# EAGLE board Stovetop-v1.1 (EAGLE 9.2.2), part 1 of 2
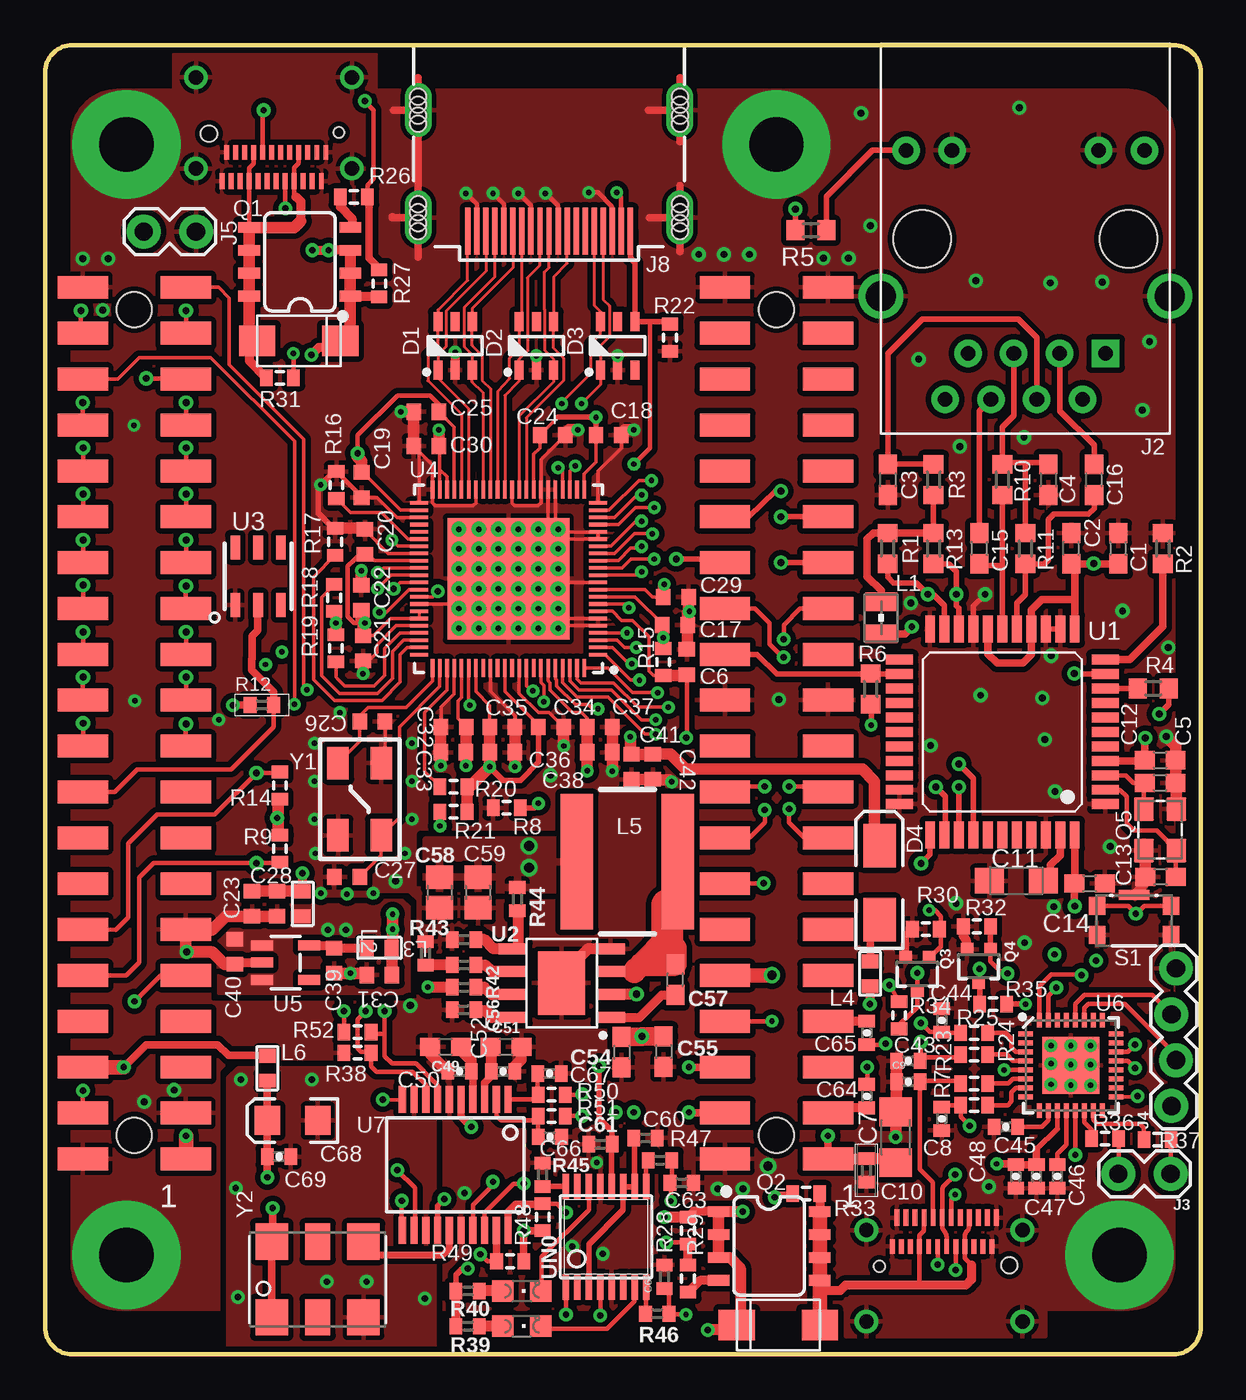
[diagram p9: board, top side]
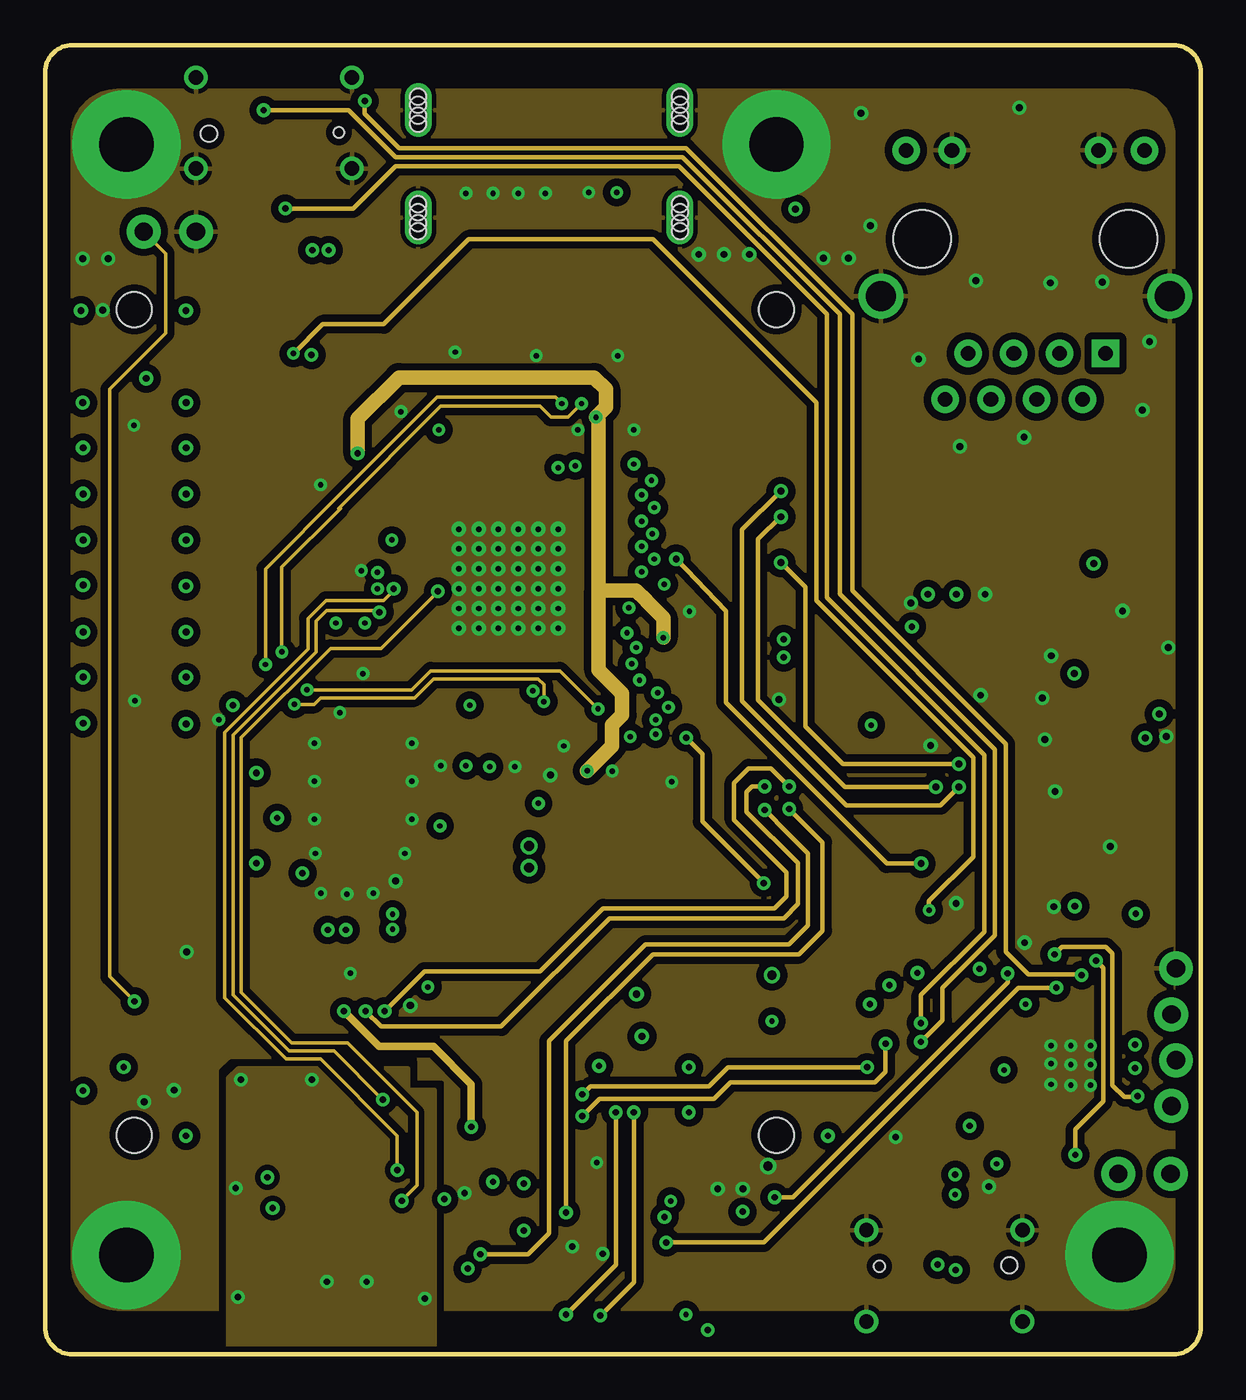
[diagram p10: board, inner layer Route2]
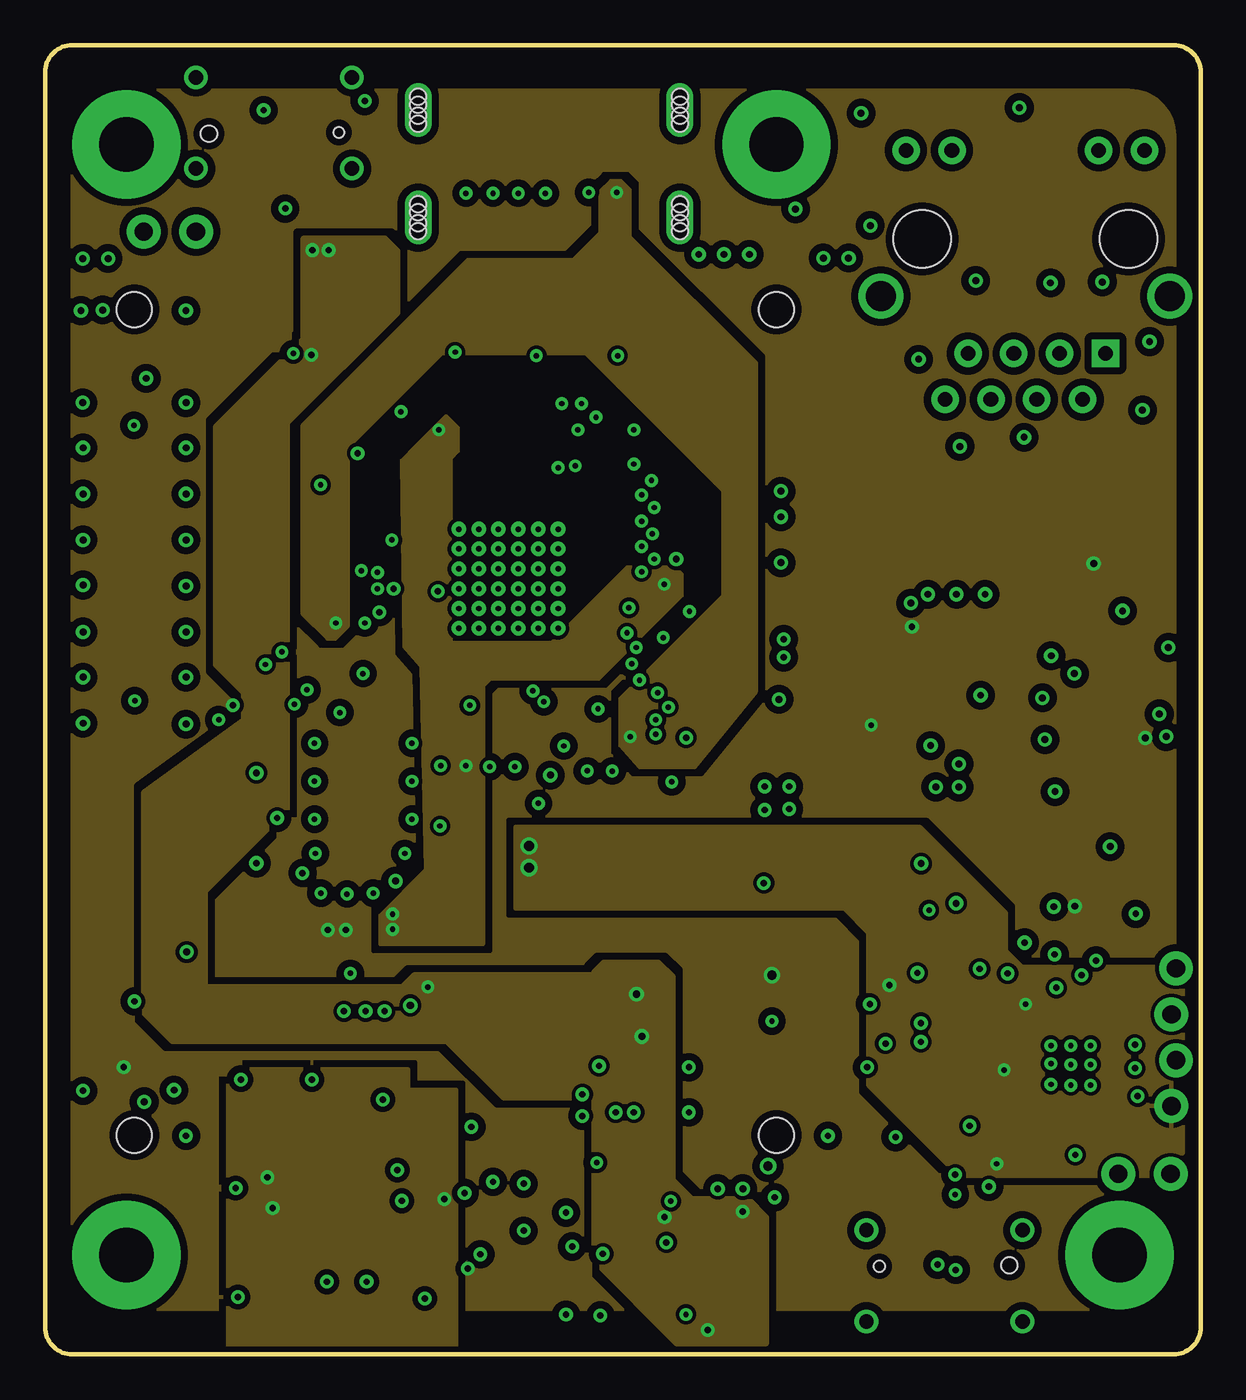
[diagram p11: board, inner layer Route15]
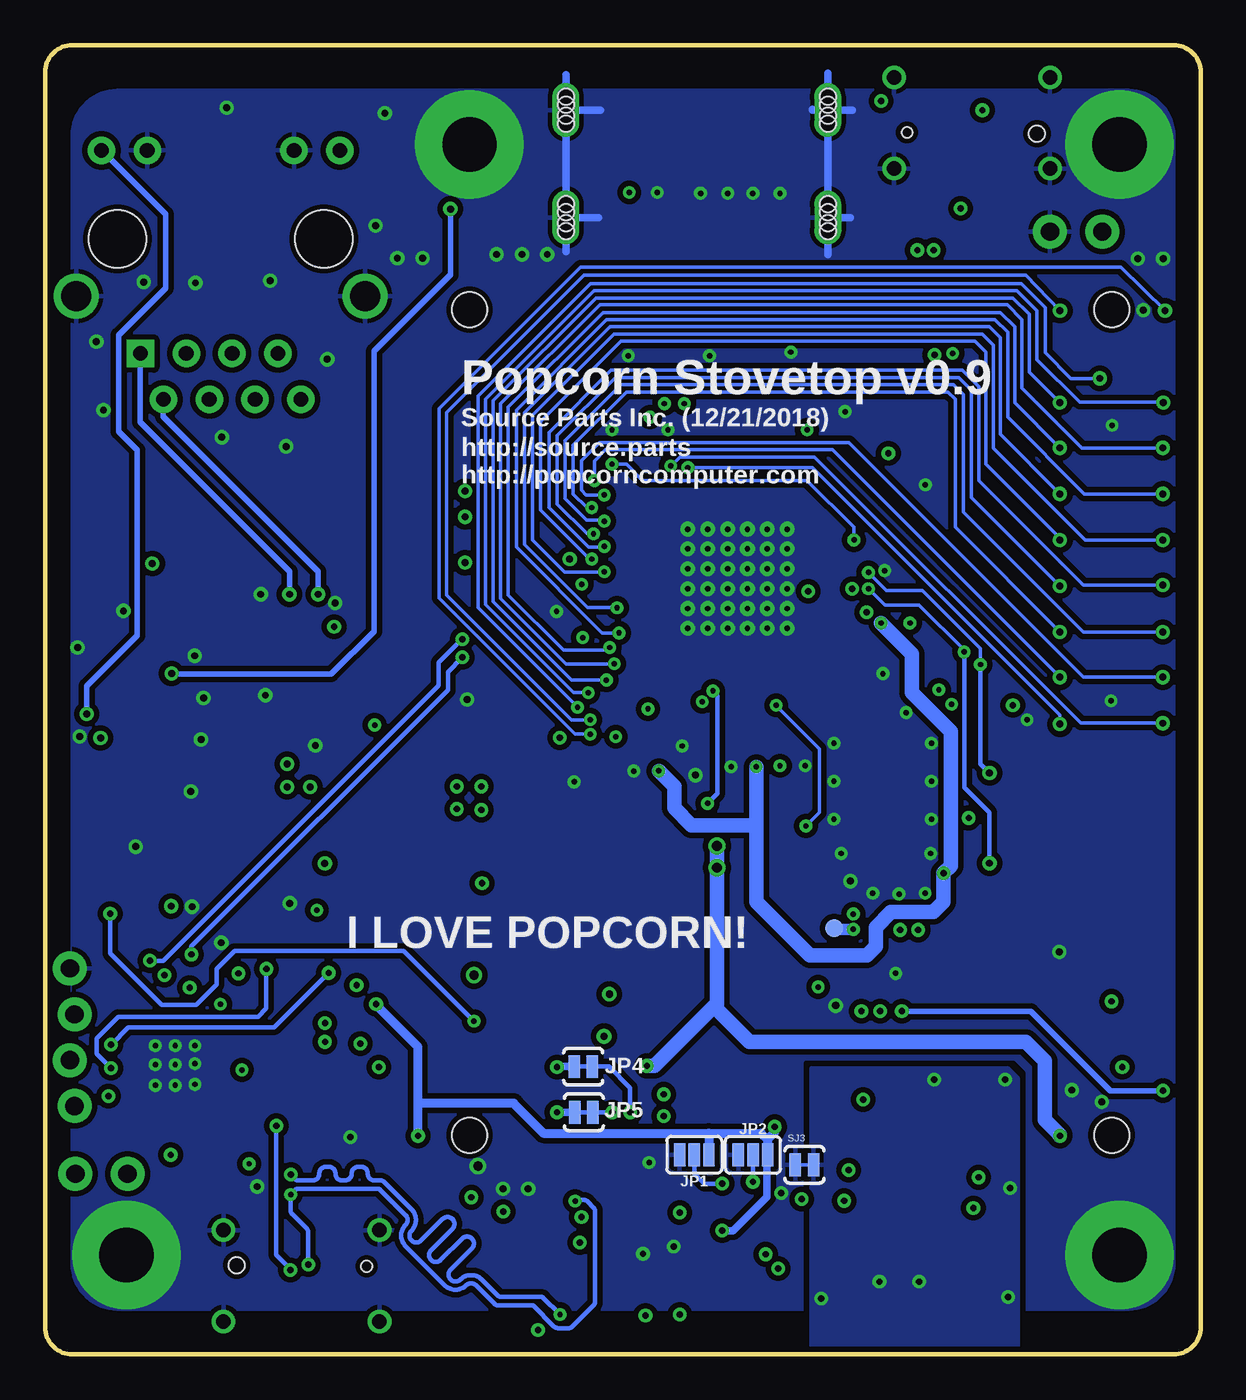
[diagram p12: board, bottom side, seen from below]

Size 64 x 72.5 mm. Coordinates in mm from the lower left corner, seen from the top.
Outline: 62.5,72.5 1.5,72.5 arc90 0,71 0,1.5 arc90 1.5,0 62.5,0 arc90 64,1.5 64,71 arc90 62.5,72.5
Copper layers (1*2*15*16): Top 0.035mm / dielectric 0.2mm / Route2 0.035mm / dielectric 0.2mm / Route15 0.035mm / dielectric 0.2mm / Bottom 0.035mm
Design rules "Stovetop *": minimum track width 8mil, minimum drill 0.3mm, track to track 8mil, track to pad 8mil, pad to pad 8mil, via to via 8mil, smd to smd 8mil, copper to edge 12mil, drill to drill 10mil, minimum pad ring 10mil, minimum via ring 8mil, stop-mask expansion 4mil, vias tented up to drill 24mil, thermal gap 10mil

## Footprints (pad centres in the part's own frame; a part is rotated, then mirrored left to right if it is on the bottom)
C0603 = smd 1.1 x 1: 1 -0.85,0; 2 0.85,0
1608_0603 = smd 0.8 x 0.9: 1 -0.7,0; 2 0.7,0
C1206 = smd 1.6 x 1.8: 1 -1.4,0; 2 1.4,0
0402-CAP = smd 0.7 x 0.9: 1 -0.65,0; 2 0.65,0
C0402 = smd 0.7 x 0.9: 1 -0.65,0; 2 0.65,0
SMC_A = smd 1.6 x 1.4: + -1.5,0; - 1.5,0
0603 = smd 1.1 x 1: 1 -0.85,0; 2 0.85,0
C0805 = smd 1.3 x 1.5: 1 -0.85,0; 2 0.85,0
EIA3216 = smd 1.4 x 1.6: A 1.4,0; C -1.4,0
T_SOT95P285X90-6N = smd 1.05 x 0.5: 1 0,0; 2 0,-0.95; 3 0,-1.9; 4 2.7,-1.9; 5 2.7,-0.95; 6 2.7,0
SMA = smd 2.4 x 1.8: 1 -2.05,0; 2 2.05,0
SMA-SS34 = smd 2 x 1.7: 1 0,-1.4; 2 4.6,-1.4
98401-801-40LF = smd 1.27 x 2.79: 1 -24.175,-2.855; 2 -24.175,2.855; 3 -21.635,-2.855; 4 -21.635,2.855; 5 -19.095,-2.855; 6 -19.095,2.855; 7 -16.555,-2.855; 8 -16.555,2.855; 9 -14.015,-2.855; 10 -14.015,2.855; 11 -11.475,-2.855; 12 -11.475,2.855; 13 -8.935,-2.855; 14 -8.935,2.855; 15 -6.395,-2.855; 16 -6.395,2.855; 17 -3.855,-2.855; 18 -3.855,2.855; 19 -1.315,-2.855; 20 -1.315,2.855; 21 1.225,-2.855; 22 1.225,2.855; 23 3.765,-2.855; 24 3.765,2.855; 25 6.305,-2.855; 26 6.305,2.855; 27 8.845,-2.855; 28 8.845,2.855; 29 11.385,-2.855; 30 11.385,2.855; 31 13.925,-2.855; 32 13.925,2.855; 33 16.465,-2.855; 34 16.465,2.855; 35 19.005,-2.855; 36 19.005,2.855; 37 21.545,-2.855; 38 21.545,2.855; 39 24.085,-2.855; 40 24.085,2.855; 41 -24.175,32.705; 42 -24.175,38.415; 43 -21.635,32.705; 44 -21.635,38.415; 45 -19.095,32.705; 46 -19.095,38.415; 47 -16.555,32.705; 48 -16.555,38.415; 49 -14.015,32.705; 50 -14.015,38.415; 51 -11.475,32.705; 52 -11.475,38.415; 53 -8.935,32.705; 54 -8.935,38.415; 55 -6.395,32.705; 56 -6.395,38.415; 57 -3.855,32.705; 58 -3.855,38.415; 59 -1.315,32.705; 60 -1.315,38.415; 61 1.225,32.705; 62 1.225,38.415; 63 3.765,32.705; 64 3.765,38.415; 65 6.305,32.705; 66 6.305,38.415; 67 8.845,32.705; 68 8.845,38.415; 69 11.385,32.705; 70 11.385,38.415; 71 13.925,32.705; 72 13.925,38.415; 73 16.465,32.705; 74 16.465,38.415; 75 19.005,32.705; 76 19.005,38.415; 77 21.545,32.705; 78 21.545,38.415; 79 24.085,32.705; 80 24.085,38.415 | hole 1.95: 22.86,0; -22.86,0; -22.86,35.56; 22.86,35.56
HR911105A = drill 0.813 pad 1.524 square: 1 4.445,-6.35 | drill 0.813 pad 1.524: 2 3.175,-8.89; 3 1.905,-6.35; 4 0.635,-8.89; 5 -0.635,-6.35; 6 -1.905,-8.89; 7 -3.175,-6.35; 8 -4.445,-8.89; 9 6.604,4.902; 10 4.064,4.902; 11 -4.064,4.902; 12 -6.604,4.902 | drill 1.651 pad 2.159: 13 8.001,-3.175; 14 -8.001,-3.175 | hole 3.2: 5.715,0; -5.715,0
1X02_LOCK = drill 1.016 pad 1.88: 1 -0.178,0; 2 2.718,0
1X04_LOCK = drill 1.016 pad 1.88: 1 0,0.127; 2 2.54,-0.127; 3 5.08,0.127; 4 7.62,-0.127
T_MOLEX_45171 = smd 0.3 x 2.6: 1 4.5,10.31; 2 4,10.31; 3 3.5,10.31; 4 3,10.31; 5 2.5,10.31; 6 2,10.31; 7 1.5,10.31; 8 1,10.31; 9 0.5,10.31; 10 0,10.31; 11 -0.5,10.31; 12 -1,10.31; 13 -1.5,10.31; 14 -2,10.31; 15 -2.5,10.31; 16 -3,10.31; 17 -3.5,10.31; 18 -4,10.31; 19 -4.5,10.31 | drill 0.9 pad 1.499 long: 20 -7.25,3.59; 21 7.25,3.59; 22 7.25,9.55; 23 -7.25,9.55 | hole 0.9: -7.25,10.3; -7.25,8.8; -7.25,9.85; -7.25,9.25; -7.25,4.35; -7.25,2.85; -7.25,3.9; -7.25,3.3; 7.25,10.3; 7.25,8.8; 7.25,9.85; 7.25,9.25; 7.25,4.35; 7.25,3.9; 7.25,2.85; 7.25,3.3
SMT-JUMPER_3_1-NC_PASTE_SILK = smd 0.635 x 1.27: 1 -0.813,0; 2 0,0; 3 0.813,0
PAD-JUMPER-2-NC_BY_TRACE_YES_SILK = smd 0.635 x 1.27: 1 -0.508,0; 2 0.508,0
WE-KI_0805_B = smd 1.02 x 1.78: 1 -0.89,0; 2 0.89,0
0603' = smd 0.762 x 0.914: 1 -0.686,0; 2 0.686,0
INDUCTOR_NR8040 = smd 7.5 x 1.8: P$1 0,2.8; P$2 0,-2.8
SO08 = smd 0.6 x 1.2: 1 -1.905,-2.8; 2 -0.635,-2.8; 3 0.635,-2.8; 4 1.905,-2.8; 5 1.905,2.8; 6 0.635,2.8; 7 -0.635,2.8; 8 -1.905,2.8
SOT323 = smd 0.7 x 0.7: 1 -0.65,-0.925; 2 0.65,-0.925; 3 0,0.925
CRISTALLI_CRYSTAL3.2X2.5 = smd 1.3 x 1.1: 1 -1.15,-0.9; 2 1.15,-0.9; 3 1.15,0.9; 4 -1.15,0.9
R0603 = smd 1 x 1.1: 1 -0.85,0; 2 0.85,0
J1-0603 = smd 0.7 x 0.9: 1 -0.75,0; 2 0.75,0
R0402 = smd 0.7 x 0.9: 1 -0.65,0; 2 0.65,0
LED-805 = smd 1.2 x 1.2: A 0,-1.05; C 0,1.05
KMR221GLFS_SW_KMR221GLFS = smd 0.9 x 1: 1 -2.05,0.8; 2 -2.05,-0.8; 3 2.05,-0.8; 4 2.05,0.8 | smd 1.7 x 0.55: 5 0,1.425
SJ_2S-TRACE = smd 0.635 x 1.27: 1 -0.508,0; 2 0.508,0
TP-1MMX1MM = smd 1 x 1: 0 0,0
TQFP44 = smd 0.55 x 1.5: P1 -4,-5.7; P2 -3.2,-5.7; P3 -2.4,-5.7; P4 -1.6,-5.7; P5 -0.8,-5.7; P6 0,-5.7; P7 0.8,-5.7; P8 1.6,-5.7; P9 2.4,-5.7; P10 3.2,-5.7; P11 4,-5.7; P23 4,5.7; P24 3.2,5.7; P25 2.4,5.7; P26 1.6,5.7; P27 0.8,5.7; P28 0,5.7; P29 -0.8,5.7; P30 -1.6,5.7; P31 -2.4,5.7; P32 -3.2,5.7; P33 -4,5.7 | smd 1.5 x 0.55: P12 5.7,-4; P13 5.7,-3.2; P14 5.7,-2.4; P15 5.7,-1.6; P16 5.7,-0.8; P17 5.7,0; P18 5.7,0.8; P19 5.7,1.6; P20 5.7,2.4; P21 5.7,3.2; P22 5.7,4; P34 -5.7,4; P35 -5.7,3.2; P36 -5.7,2.4; P37 -5.7,1.6; P38 -5.7,0.8; P39 -5.7,0; P40 -5.7,-0.8; P41 -5.7,-1.6; P42 -5.7,-2.4; P43 -5.7,-3.2; P44 -5.7,-4
SOIC-8-PAD = smd 1.6 x 0.61: 1 -2.7,1.905; 2 -2.7,0.635; 3 -2.7,-0.635; 4 -2.7,-1.905; 5 2.7,-1.905; 6 2.7,-0.635; 7 2.7,0.635; 8 2.7,1.905 | smd 2.62 x 3.51: PAD 0,0
TSOC6 = smd 0.53 x 1.33: 1 -1.27,-1.6; 2 0,-1.6; 3 1.27,-1.6; 4 1.27,1.6; 5 0,1.6; 6 -1.27,1.6
QFN40P1000X1000X90_HS-89M = smd 1 x 0.2: 1 -4.95,4.2; 2 -4.95,3.8; 3 -4.95,3.4; 4 -4.95,3; 5 -4.95,2.6; 6 -4.95,2.2; 7 -4.95,1.8; 8 -4.95,1.4; 9 -4.95,1; 10 -4.95,0.6; 11 -4.95,0.2; 12 -4.95,-0.2; 13 -4.95,-0.6; 14 -4.95,-1; 15 -4.95,-1.4; 16 -4.95,-1.8; 17 -4.95,-2.2; 18 -4.95,-2.6; 19 -4.95,-3; 20 -4.95,-3.4; 21 -4.95,-3.8; 22 -4.95,-4.2; 45 4.95,-4.2; 46 4.95,-3.8; 47 4.95,-3.4; 48 4.95,-3; 49 4.95,-2.6; 50 4.95,-2.2; 51 4.95,-1.8; 52 4.95,-1.4; 53 4.95,-1; 54 4.95,-0.6; 55 4.95,-0.2; 56 4.95,0.2; 57 4.95,0.6; 58 4.95,1; 59 4.95,1.4; 60 4.95,1.8; 61 4.95,2.2; 62 4.95,2.6; 63 4.95,3; 64 4.95,3.4; 65 4.95,3.8; 66 4.95,4.2 | smd 0.2 x 1: 23 -4.2,-4.95; 24 -3.8,-4.95; 25 -3.4,-4.95; 26 -3,-4.95; 27 -2.6,-4.95; 28 -2.2,-4.95; 29 -1.8,-4.95; 30 -1.4,-4.95; 31 -1,-4.95; 32 -0.6,-4.95; 33 -0.2,-4.95; 34 0.2,-4.95; 35 0.6,-4.95; 36 1,-4.95; 37 1.4,-4.95; 38 1.8,-4.95; 39 2.2,-4.95; 40 2.6,-4.95; 41 3,-4.95; 42 3.4,-4.95; 43 3.8,-4.95; 44 4.2,-4.95; 67 4.2,4.95; 68 3.8,4.95; 69 3.4,4.95; 70 3,4.95; 71 2.6,4.95; 72 2.2,4.95; 73 1.8,4.95; 74 1.4,4.95; 75 1,4.95; 76 0.6,4.95; 77 0.2,4.95; 78 -0.2,4.95; 79 -0.6,4.95; 80 -1,4.95; 81 -1.4,4.95; 82 -1.8,4.95; 83 -2.2,4.95; 84 -2.6,4.95; 85 -3,4.95; 86 -3.4,4.95; 87 -3.8,4.95; 88 -4.2,4.95 | smd 6.75 x 6.75: 89 0,0 | drill 0.3 pad 0.61: P$1 -2.75,2.75; P$2 2.75,2.75; P$3 -2.75,-2.75; P$4 2.75,-2.75; P$5 -1.65,2.75; P$6 -0.55,2.75; P$7 1.65,2.75; P$8 0.55,2.75; P$9 -1.65,-2.75; P$10 -0.55,-2.75; P$11 1.65,-2.75; P$12 0.55,-2.75; P$13 -2.75,1.65; P$14 -2.75,0.55; P$15 -2.75,-0.55; P$16 -2.75,-1.65; P$17 2.75,1.65; P$18 2.75,0.55; P$19 2.75,-0.55; P$20 2.75,-1.65; P$21 -1.65,1.65; P$22 -0.55,1.65; P$23 0.55,1.65; P$24 1.65,1.65; P$25 -1.65,0.55; P$26 -0.55,0.55; P$27 0.55,0.55; P$28 1.65,0.55; P$29 -1.65,-0.55; P$30 -0.55,-0.55; P$31 0.55,-0.55; P$32 1.65,-0.55; P$33 1.65,-1.65; P$34 0.55,-1.65; P$35 -0.55,-1.65; P$36 -1.65,-1.65
SOT23-5 = smd 0.559 x 1.219: 1 -0.95,-1.3; 2 0,-1.3; 3 0.965,-1.3; 4 0.965,1.321; 5 -0.95,1.321
QFN-32-5X5MM = smd 0.285 x 0.8: 1 -1.75,-2.5; 2 -1.25,-2.5; 3 -0.75,-2.5; 4 -0.25,-2.5; 5 0.25,-2.5; 6 0.75,-2.5; 7 1.25,-2.5; 8 1.75,-2.5; 17 1.75,2.5; 18 1.25,2.5; 19 0.75,2.5; 20 0.25,2.5; 21 -0.25,2.5; 22 -0.75,2.5; 23 -1.25,2.5; 24 -1.75,2.5 | smd 0.8 x 0.285: 9 2.5,-1.75; 10 2.5,-1.25; 11 2.5,-0.75; 12 2.5,-0.25; 13 2.5,0.25; 14 2.5,0.75; 15 2.5,1.25; 16 2.5,1.75; 25 -2.5,1.75; 26 -2.5,1.25; 27 -2.5,0.75; 28 -2.5,0.25; 29 -2.5,-0.25; 30 -2.5,-0.75; 31 -2.5,-1.25; 32 -2.5,-1.75 | smd 3.15 x 3.15: EP 0,0
SSOP20 = smd 0.4 x 1.5: 1 -2.925,-3.625; 2 -2.275,-3.625; 3 -1.625,-3.625; 4 -0.975,-3.625; 5 -0.325,-3.625; 6 0.325,-3.625; 7 0.975,-3.625; 8 1.625,-3.625; 9 2.275,-3.625; 10 2.925,-3.625; 11 2.925,3.625; 12 2.275,3.625; 13 1.625,3.625; 14 0.975,3.625; 15 0.325,3.625; 16 -0.325,3.625; 17 -0.975,3.625; 18 -1.625,3.625; 19 -2.275,3.625; 20 -2.925,3.625
SSOP-16 = smd 0.35 x 1.4: 1 -2.223,-2.775; 2 -1.587,-2.775; 3 -0.953,-2.775; 4 -0.318,-2.775; 5 0.318,-2.775; 6 0.953,-2.775; 7 1.587,-2.775; 8 2.223,-2.775; 9 2.223,2.775; 10 1.587,2.775; 11 0.953,2.775; 12 0.318,2.775; 13 -0.318,2.775; 14 -0.953,2.775; 15 -1.587,2.775; 16 -2.223,2.775
DX07S0224JJ2_USB-C = smd 0.27 x 0.9: A1 0.975,2.7; A2 1.475,2.7; A3 1.975,2.7; A4 2.475,2.7; A5 2.975,2.7; A6 3.475,2.7; A7 3.975,2.7; A8 4.475,2.7; A9 4.975,2.7; A10 5.475,2.7; A11 5.975,2.7; A12 6.475,2.7 | smd 0.27 x 0.8: B1 6.225,1.1; B2 5.725,1.1; B3 5.225,1.1; B4 4.725,1.1; B5 4.225,1.1; B6 3.725,1.1; B7 3.225,1.1; B8 2.725,1.1; B9 2.225,1.1; B10 1.725,1.1; B11 1.225,1.1; B12 0.725,1.1 | drill 0.8: SHIELD0 -0.72,2; SHIELD1 7.92,2; SHIELD2 7.92,-3.05; SHIELD3 -0.72,-3.05 | hole 0.6: 0,0; 0,0 | hole 0.9: 7.2,0.065
ABM3B = smd 1.8 x 1.2: 1 -2,-1.2; 2 2,-1.2; 3 2,1.2; 4 -2,1.2
CRYSTAL-SMD-7.5X5.2-6PIN = smd 1.8 x 2: 1 -2.54,-2.1; 2 2.54,-2.1; 3 2.54,2.1; 4 -2.54,2.1 | smd 1.4 x 2: NC0 0,-2.1; NC1 0,2.1

## Placement (x,y rotation side)
C1  0.1uF  [C0603]  59.44,44.63 90 top
C2  0.1uF  [C0603]  56.82,44.63 90 top
C3  0.01uF  [C0603]  46.66,48.44 270 top
C4  0.01uF  [C0603]  55.55,48.44 270 top
C5  0.1uF  [C0603]  61.75,32.9 0 top
C6  100nF  [1608_0603]  35.53,38.34 270 top
C7  22uF  [C1206]  47.11,12.02 90 top
C8  220pF/16V  [0402-CAP]  49.65,13.05 90 top
C9  220pF/16V  [0402-CAP]  47.8,15.1 0 top
C10  100nF  [C0402]  45.47,10.19 270 top
C11  10uF  [SMC_A]  53.78,26.23 180 top
C12  27pf  [C0603]  61.75,31.65 0 top
C13  27pf  [C0603]  61.77,26.44 180 top
C14  0.1uF  [C0603]  57.84,26.07 0 top
C15  6.8nF  [C0603]  51.74,44.63 90 top
C16  6.8nF  [C0603]  58.09,48.44 90 top
C17  100nF  [1608_0603]  34.88,40.39 0 top
C18  100nF  [1608_0603]  31.21,50.9 0 top
C19  100nF  [1608_0603]  17.53,48.14 270 top
C20  100nF  [1608_0603]  17.71,45 90 top
C21  100nF  [1608_0603]  17.61,39.1 270 top
C22  100nF  [1608_0603]  17.51,41.9 90 top
C23  10uF  [1608_0603]  11.45,24.96 270 top
C24  100nF  [1608_0603]  28.11,50.9 0 top
C25  100nF  [1608_0603]  21.11,52.2 180 top
C26  18pF  [1608_0603]  18.12,35.04 180 top
C27  18pF  [1608_0603]  16.72,26.44 0 top
C28  10uF  [1608_0603]  12.85,24.96 270 top
C29  100nF  [1608_0603]  34.93,41.94 0 top
C30  100nF  [1608_0603]  21.11,50.3 180 top
C31  10uF  [1608_0603]  18.51,21 180 top
C32  100nF  [1608_0603]  22.62,34.74 180 top
C33  10uF  [1608_0603]  22.61,33.34 180 top
C34  100nF  [1608_0603]  28.02,34.74 0 top
C35  100nF  [1608_0603]  25.32,34.74 0 top
C36  10uF  [1608_0603]  25.32,33.34 0 top
C37  100nF  [1608_0603]  30.72,34.74 0 top
C38  10uF  [1608_0603]  30.72,33.34 0 top
C39  4.7uF  [1608_0603]  16.01,21.8 270 top
C40  4.7uF  [1608_0603]  10.51,22.3 270 top
C41  100nF  [1608_0603]  32.47,32.54 270 top
C42  10uF  [1608_0603]  33.65,32.54 270 top
C43  220pF/16V  [0402-CAP]  47.8,16.25 0 top
C44  220pF/16V  [0402-CAP]  49.65,18.5 270 top
C45  4.7uF  [0402-CAP]  53.2,12.6 0 top
C46  1uF  [0402-CAP]  56.05,9.85 90 top
C47  10uF/16V  [0402-CAP]  54.9,9.85 90 top
C48  0.1uF  [0402-CAP]  53.75,9.85 90 top
C49  4.7uF  [0603]  22.18,17.02 180 top
C50  0.1uF  [0402-CAP]  22.95,15.66 180 top
C51  4.7uF  [0603]  25.52,17.02 0 top
C52  0.1uF  [0402-CAP]  25.36,15.66 0 top
C53  DNP  [C0402]  23.2,21.56 180 top
C54  10uF  [C0603]  31.93,16.73 270 top
C55  10uF  [C0603]  34.25,16.76 270 top
C56  0.1uF  [C0402]  23.19,19.08 180 top
C57  10000pF  [C0603]  34.9,20.75 90 top
C58  22uF  [C0805]  21.85,25.59 270 top
C59  22uF  [C0805]  23.97,25.59 270 top
C60  0.1uF  [C0402]  33.25,11.98 0 top
C61  10uF  [C0402]  30.75,11.64 180 top
C62  47pF  [C0402]  34.3,4.3 90 top
C63  47pF  [C0402]  35.25,9.5 0 top
C64  0.1uF  [0402-CAP]  45.5,14.3 90 top
C65  0.1uF  [0402-CAP]  45.5,17.8 270 top
C66  0.1uF  [0402-CAP]  27.95,12.05 180 top
C67  0.1uF  [0402-CAP]  27.93,15.55 180 top
C68  10uF  [EIA3216]  13.7,12.95 180 top
C69  0.1uF  [0402-CAP]  12.95,10.95 0 top
D1  D-SEMTECH-RCLAMP0504S  [T_SOT95P285X90-6N]  21.76,54.5 90 top
D2  D-SEMTECH-RCLAMP0504S  [T_SOT95P285X90-6N]  26.26,54.5 90 top
D3  D-SEMTECH-RCLAMP0504S  [T_SOT95P285X90-6N]  30.76,54.5 90 top
D4  B240A  [SMA]  46.21,26.12 90 top
D5  SMA-SS34  [SMA-SS34]  11.75,57.52 0 top
D6  SMA-SS34  [SMA-SS34]  42.9,0.23 180 top
J1  98401-801-40LF  [98401-801-40LF]  40.5,35 90 top
J2  HR911105A  [HR911105A]  54.28,61.77 0 top
J3  [1X02_LOCK]  62.15,10 180 top
J4  [1X04_LOCK]  62.5,13.75 90 top
J5  [1X02_LOCK]  8.18,62.17 180 top
J8  T_MOLEX_45171  [T_MOLEX_45171]  27.91,72.5 180 top
JP1  JUMPER-SMT_3_1-NC_PASTE_SILK  [SMT-JUMPER_3_1-NC_PASTE_SILK]  28.05,11.05 180 bottom
JP2  JUMPER-SMT_3_1-NC_PASTE_SILK  [SMT-JUMPER_3_1-NC_PASTE_SILK]  24.8,11.05 0 bottom
JP4  JUMPER-PAD-2-NC_BY_TRACE  [PAD-JUMPER-2-NC_BY_TRACE_YES_SILK]  34.2,15.94 180 bottom
JP5  JUMPER-PAD-2-NC_BY_TRACE  [PAD-JUMPER-2-NC_BY_TRACE_YES_SILK]  34.17,13.41 180 bottom
L1  [WE-KI_0805_B]  46.3,40.79 90 top
L2  ACML  [0603']  14.25,24.96 270 top
L3  ACML  [0603']  18.51,22.5 180 top
L4  ACML  [0603']  45.7,21.08 90 top
L5  10uH  [INDUCTOR_NR8040]  32.24,27.28 270 top
L6  ACML  [0603']  12.3,15.85 270 top
Q1  6.5A/20V/35mΩ  [SO08]  14.1,60.5 90 top
Q2  6.5A/20V/35mΩ  [SO08]  40.1,6 270 top
Q3  310mA/60V/1.6Ω  [SOT323]  48.3,21.07 180 top
Q4  310mA/60V/1.6Ω  [SOT323]  51.7,21.5 180 top
Q5  FTX25.000M12SM3S  [CRISTALLI_CRYSTAL3.2X2.5]  61.75,29.05 270 top
R1  49R9 1%  [R0603]  46.66,44.63 90 top
R2  12.4K 1%  [R0603]  61.9,44.63 90 top
R3  10R, 1/12W, 1%  [R0603]  49.2,48.44 90 top
R4  1K1  [R0603]  61.37,36.88 0 top
R5  1K1  [R0603]  42.41,62.24 0 top
R6  100K  [R0603]  45.72,36.85 90 top
R7  10R  [J1-0603]  51.45,13.8 0 top
R8  1.2K  [J1-0603]  25.56,30.27 0 top
R9  6.7K  [J1-0603]  13.01,31.5 270 top
R10  49R9 1%  [R0603]  53.01,48.44 90 top
R11  49R9 1%  [R0603]  54.28,44.63 90 top
R12  4.7K  [R0402]  12.01,35.96 180 top
R13  49R9 1%  [R0603]  49.2,44.63 90 top
R14  6.7K  [J1-0603]  13.01,28 90 top
R15  1M  [J1-0603]  34.23,38.34 90 top
R16  10k  [J1-0603]  16.13,48.14 90 top
R17  10k  [J1-0603]  16.06,45 90 top
R18  10k  [J1-0603]  16.01,41.9 270 top
R19  10k  [J1-0603]  16.11,39.1 90 top
R20  10k  [J1-0603]  22.62,31.44 0 top
R21  10k  [J1-0603]  22.62,30.04 0 top
R22  47k  [J1-0603]  34.61,56.3 90 top
R23  10R  [J1-0603]  51.45,15 0 top
R24  10R  [J1-0603]  51.45,16.6 0 top
R25  10R  [J1-0603]  51.45,17.8 0 top
R26  10K  [J1-0603]  17.1,64.1 180 top
R27  10K  [J1-0603]  18.5,59.3 270 top
R28  10K  [J1-0603]  35.6,6.85 90 top
R29  10K  [J1-0603]  35.6,4.2 270 top
R30  12K  [J1-0603]  48.77,23.55 0 top
R31  36K  [J1-0603]  13,54.08 180 top
R32  12K  [J1-0603]  51.6,23.7 0 top
R33  36K  [J1-0603]  42.15,8.9 180 top
R34  100K  [J1-0603]  47.3,18.77 90 top
R35  100K  [J1-0603]  52.5,19.4 0 top
R36  10R  [J1-0603]  58.7,11.95 180 top
R37  10R  [J1-0603]  61.6,11.9 180 top
R38  1M  [J1-0603]  17.3,16.7 0 top
R39  1K  [R0402]  23.4,1.56 0 top
R40  1K  [R0402]  23.4,3.51 0 top
R41  DNP  [R0402]  21.07,22.21 270 top
R42  100K  [R0402]  23.2,20.33 180 top
R43  10K  [R0402]  23.2,22.97 0 top
R44  44.2K  [R0402]  26.15,25.21 270 top
R45  0  [R0402]  27.55,9.95 270 top
R46  27R  [R0402]  33.9,2.25 0 top
R47  27R  [R0402]  34.05,10.75 0 top
R48  1M  [J1-0603]  27.55,7.6 270 top
R49  1M  [J1-0603]  25.75,5.15 0 top
R50  1M  [J1-0603]  28.05,14.38 0 top
R51  1M  [J1-0603]  28.05,13.2 0 top
R52  1M  [J1-0603]  17.3,17.85 180 top
RX_LED  Blue  [LED-805]  26.4,1.56 270 top
S1  KMR221GLFS_KMR221GLFS  [KMR221GLFS_SW_KMR221GLFS]  60.3,24.02 0 top
SJ3  SOLDERJUMPERTRACE  [SJ_2S-TRACE]  21.95,10.5 0 bottom
TP1  TEST_POINT  [TP-1MMX1MM]  20.31,23.61 180 bottom
TX_LED  Amber  [LED-805]  26.4,3.51 270 top
U1  ENC424J600  [TQFP44]  53.01,34.47 90 top
U2  MP2307  [SOIC-8-PAD]  28.6,20.56 180 top
U3  DS2431P  [TSOC6]  11.8,43.08 0 top
U4  CH7053A  [QFN40P1000X1000X90_HS-89M]  25.66,42.95 180 top
U5  LP5907MFX  [SOT23-5]  13.31,21.7 270 top
U6  LDR6282  [QFN-32-5X5MM]  56.8,16 270 top
U7  PCM1803SMD  [SSOP20]  22.71,10.5 180 top
UN0  FT230XS  [SSOP-16]  31.06,6.51 0 top
USB-C  DX07S024JJ2_USB_TYPE-C  [DX07S0224JJ2_USB-C]  16.27,67.67 180 top
USB-C1  DX07S024JJ2_USB_TYPE-C  [DX07S0224JJ2_USB-C]  46.2,4.88 0 top
Y1  ABM3B  [ABM3B]  17.42,30.74 270 top
Y2  24.576MHz OSCILLATOR  [CRYSTAL-SMD-7.5X5.2-6PIN]  15.09,4.15 0 top